# EAGLE design Teensy-FC-BOB2 (EAGLE 8.0.0)
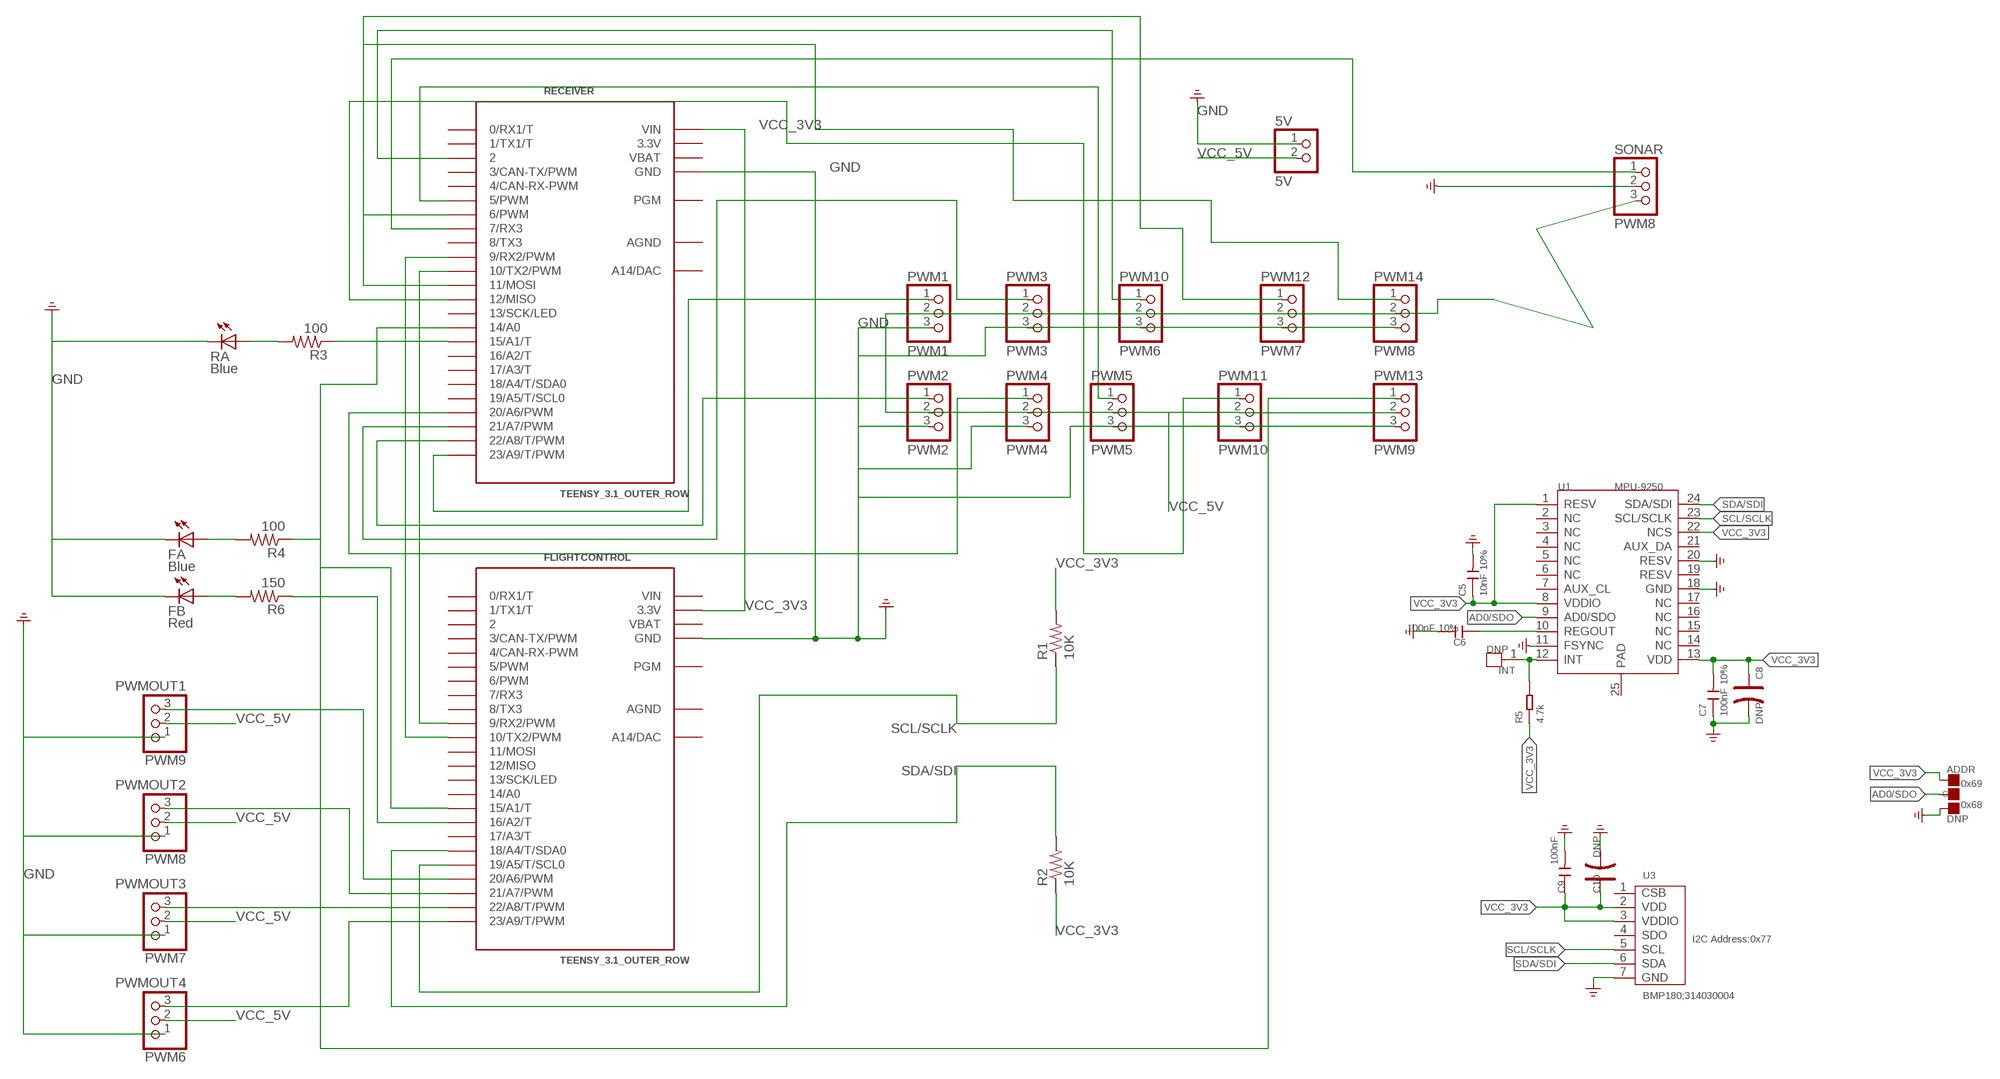
[diagram p0: schematic, sheet 1]

## Parts
5V  5V  PINHD-1X2  [1X02]
ADDR  DNP  PAD-JUMPER-3P-40*40  [3P-SMD-L4.1*W1.5MM]
C5  10nF 10%  CAP-0603  [C0603]
C6  100nF 10%  CAP-0603  [C0603]
C7  100nF 10%  CAP-0603  [C0603]
C8  DNP  CAP-POLAR-AVX-A  [AVX-A]
C9  100nF  CAP-0603  [C0603]
C10  DNP  CAP-POLAR-AVX-A  [AVX-A]
FA  Blue  LEDCHIP-LED0603  [CHIP-LED0603]
FB  Red  LEDCHIP-LED0603  [CHIP-LED0603]
FLIGHTCONTROL  TEENSY_3.1_OUTER_ROW  [TEENSY3-OUTER_ROW]
INT  DNP  HEADER-1P-35  [1P-65/35MIL]
PWM1  PWM1  PINHD-1X3  [1X03]
PWM2  PWM2  PINHD-1X3  [1X03]
PWM3  PWM3  PINHD-1X3  [1X03]
PWM4  PWM4  PINHD-1X3  [1X03]
PWM5  PWM5  PINHD-1X3  [1X03]
PWM6  PWMOUT4  PINHD-1X3  [1X03]
PWM7  PWMOUT3  PINHD-1X3  [1X03]
PWM8  PWMOUT2  PINHD-1X3  [1X03]
PWM9  PWMOUT1  PINHD-1X3  [1X03]
PWM10  PWM6  PINHD-1X3  [1X03]
PWM11  PWM10  PINHD-1X3  [1X03]
PWM12  PWM7  PINHD-1X3  [1X03]
PWM13  PWM9  PINHD-1X3  [1X03]
PWM14  PWM8  PINHD-1X3  [1X03]
R1  10K  R-US_R0603  [R0603]
R2  10K  R-US_R0603  [R0603]
R3  100  R-US_R0603  [R0603]
R4  100  R-US_R0603  [R0603]
R5  4.7k  RES-0603  [R0603]
R6  150  R-US_R0603  [R0603]
RA  Blue  LEDCHIP-LED0603  [CHIP-LED0603]
RECEIVER  TEENSY_3.1_OUTER_ROW  [TEENSY3-OUTER_ROW]
SONAR  PWM8  PINHD-1X3  [1X03]
U1  MPU-9250  [LEAD-QFN24]
U3  BMP180;314030004  BMP180  [LGA-7]

## Nets
AD0/SDO: ADDR.MM(C) U1.9(AD0/SDO)
GND: 5V.1 ADDR.11(R) C5.2 C6.2 C7.1 C8.- C9.2 C10.- FA.C FB.C FLIGHTCONTROL.GND FLIGHTCONTROL.GND1(GND) PWM1.3 PWM2.3 PWM3.3 PWM4.3 PWM5.3 PWM6.1 PWM7.1 PWM8.1 PWM9.1 PWM10.3 PWM11.3 PWM12.3 PWM13.3 PWM14.3 RA.C RECEIVER.GND RECEIVER.GND1(GND) SONAR.2 U1.11(FSYNC) U1.18(GND) U1.20(RESV) U3.7(GND) ; supply symbol labelled GND_POWER
N$1: FLIGHTCONTROL.9(9/RX2/PWM) RECEIVER.10(10/TX2/PWM)
N$2: FLIGHTCONTROL.10(10/TX2/PWM) RECEIVER.9(9/RX2/PWM)
N$3: C6.1 U1.10(REGOUT)
N$4: INT.1 R5.2 U1.12(INT)
N$5: PWM1.1 RECEIVER.23/A9(23/A9/T/PWM)
N$6: PWM2.1 RECEIVER.22/A8(22/A8/T/PWM)
N$7: PWM3.1 RECEIVER.21/A7(21/A7/PWM)
N$8: PWM4.1 RECEIVER.20/A6(20/A6/PWM)
N$9: PWM5.1 RECEIVER.5(5/PWM)
N$10: FLIGHTCONTROL.20/A6(20/A6/PWM) PWM9.3
N$11: FLIGHTCONTROL.21/A7(21/A7/PWM) PWM8.3
N$12: FLIGHTCONTROL.22/A8(22/A8/T/PWM) PWM7.3
N$13: FLIGHTCONTROL.23/A9(23/A9/T/PWM) PWM6.3
N$14: FLIGHTCONTROL.15/A1(15/A1/T) R4.1
N$15: FA.A R4.2
N$16: R3.1 RECEIVER.15/A1(15/A1/T)
N$17: R3.2 RA.A
N$18: FLIGHTCONTROL.16/A2(16/A2/T) R6.1
N$19: FB.A R6.2
N$20: PWM10.1 RECEIVER.2
N$21: RECEIVER.7(7/RX3) SONAR.1
N$22: PWM1.2 PWM2.2 PWM3.2 PWM4.2 PWM5.2 PWM10.2 PWM11.2 PWM12.2 PWM13.2 PWM14.2 SONAR.3
N$23: PWM12.1 RECEIVER.6(6/PWM)
N$24: PWM14.1 RECEIVER.11(11/MOSI)
N$25: PWM11.1 RECEIVER.12(12/MISO)
N$26: PWM13.1 RECEIVER.14/A0
SCL/SCLK: FLIGHTCONTROL.19/A5(19/A5/T/SCL0) R1.1 U1.23(SCL/SCLK) U3.5(SCL)
SDA/SDI: FLIGHTCONTROL.18/A4(18/A4/T/SDA0) R2.2 U1.24(SDA/SDI) U3.6(SDA)
VCC_3V3: ADDR.00(L) C5.1 C7.2 C8.+ C9.1 C10.+ FLIGHTCONTROL.3.3V FLIGHTCONTROL.3.3V1(3.3V) R1.2 R2.1 R5.1 RECEIVER.VIN U1.1(RESV) U1.8(VDDIO) U1.13(VDD) U1.22(NCS) U3.2(VDD) U3.3(VDDIO)
VCC_5V: 5V.2 PWM6.2 PWM7.2 PWM8.2 PWM9.2
Unconnected: FLIGHTCONTROL.0(0/RX1/T) FLIGHTCONTROL.1(1/TX1/T) FLIGHTCONTROL.2 FLIGHTCONTROL.3(3/CAN-TX/PWM) FLIGHTCONTROL.4(4/CAN-RX-PWM) FLIGHTCONTROL.5(5/PWM) FLIGHTCONTROL.6(6/PWM) FLIGHTCONTROL.7(7/RX3) FLIGHTCONTROL.8(8/TX3) FLIGHTCONTROL.11(11/MOSI) FLIGHTCONTROL.12(12/MISO) FLIGHTCONTROL.13(13/SCK/LED) FLIGHTCONTROL.14/A0 FLIGHTCONTROL.17/A3(17/A3/T) FLIGHTCONTROL.PGM FLIGHTCONTROL.RESET/DAC(A14/DAC) RECEIVER.0(0/RX1/T) RECEIVER.1(1/TX1/T) RECEIVER.3(3/CAN-TX/PWM) RECEIVER.4(4/CAN-RX-PWM) RECEIVER.8(8/TX3) RECEIVER.13(13/SCK/LED) RECEIVER.16/A2(16/A2/T) RECEIVER.17/A3(17/A3/T) RECEIVER.18/A4(18/A4/T/SDA0) RECEIVER.19/A5(19/A5/T/SCL0) RECEIVER.PGM RECEIVER.RESET/DAC(A14/DAC) U1.2(NC) U1.3(NC) U1.4(NC) U1.5(NC) U1.6(NC) U1.7(AUX_CL) U1.14(NC) U1.15(NC) U1.16(NC) U1.17(NC) U1.19(RESV) U1.21(AUX_DA) U1.25(PAD) U3.1(CSB) U3.4(SDO)

## Notes on the sheet
- 0x69
- 0x68
- I2C Address:0x77

## Power pins joined to a net without a drawn wire
3.3V: RECEIVER.3.3V RECEIVER.3.3V1(3.3V)
AGND: FLIGHTCONTROL.AGND RECEIVER.AGND
VBAT: FLIGHTCONTROL.VBAT RECEIVER.VBAT
VIN: FLIGHTCONTROL.VIN

## Library data of the parts
5V = pinhead:PINHD-1X2: PIN HEADER
ADDR = Discrete-new:PAD-JUMPER-3P; PARTNO: DNP
C5-C7 C9 = Discrete-new:CAP: Ceramic Capacitors
C8 C10 = Discrete-new:CAP-POLAR: Electrolytic Capacitors,Tantalum Capacitors and Super Capacitors
FA FB RA = led:LED: LED OSRAM: - CHIPLED LG R971, LG N971, LY N971, LG Q971, LY Q971, LO R971, LY R971 LH N974, LH R974 LS Q976, LO Q976, LY Q976 LO Q996 - Hyper CHIPLED LW Q18S LB Q993, LB Q99A, LB R99A - SideLED LS A670, LO A670, LY A670, LG A670, LP A670 LB A673, LV A673, LT A673, LW A673 LH A674 LY A675 LS A676, LA A676, LO A676, LY A676, LW A676 LS A679, LY A679, LG A679 - Hyper Micro SIDELED® LS Y876, LA Y876, LO Y876, LY Y876 LT Y87S - SmartLED LW L88C, LW L88S LB L89C, LB L89S, LG L890 LS L89K, LO L89K, LY L89K LS L896, LA L896, LO L896, LY L896 - TOPLED LS T670, LO T670, LY T670, LG T670, LP T670 LSG T670, LSP T670, LSY T670, LOP T670, LYG T670 LG T671, LOG T671, LSG T671 LB T673, LV T673, LT T673, LW T673 LH T674 LS T676, LA T676, LO T676, LY T676, LB T676, LH T676, LSB T676, LW T676 LB T67C, LV T67C, LT T67C, LS T67K, LO T67K, LY T67K, LW E67C LS E67B, LA E67B, LO E67B, LY E67B, LB E67C, LV E67C, LT E67C LW T67C LS T679, LY T679, LG T679 LS T770, LO T770, LY T770, LG T770, LP T770 LB T773, LV T773, LT T773, LW T773 LH T774 LS E675, LA E675, LY E675, LS T675 LS T776, LA T776, LO T776, LY T776, LB T776 LHGB T686 LT T68C, LB T68C - Hyper Mini TOPLED® LB M676 - Mini TOPLED Santana® LG M470 LS M47K, LO M47K, LY M47K Source: http://www.osram.convergy.de LUXEON: - LUMILED® LXK2-PW12-R00, LXK2-PW12-S00, LXK2-PW14-U00, LXK2-PW14-V00 LXK2-PM12-R00, LXK2-PM12-S00, LXK2-PM14-U00 LXK2-PE12-Q00, LXK2-PE12-R00, LXK2-PE12-S00, LXK2-PE14-T00, LXK2-PE14-U00 LXK2-PB12-K00, LXK2-PB12-L00, LXK2-PB12-M00, LXK2-PB14-N00, LXK2-PB14-P00, LXK2-PB14-Q00 LXK2-PR12-L00, LXK2-PR12-M00, LXK2-PR14-Q00, LXK2-PR14-R00 LXK2-PD12-Q00, LXK2-PD12-R00, LXK2-PD12-S00 LXK2-PH12-R00, LXK2-PH12-S00 LXK2-PL12-P00, LXK2-PL12-Q00, LXK2-PL12-R00 Source: www.luxeon.com KINGBRIGHT: KA-3528ASYC Source: www.kingbright.com
FLIGHTCONTROL RECEIVER = Teensy_3_and_LC_Series_Boards_v1.0:TEENSY_3.1_OUTER_ROW: Footprint for Teensy 3.1 or 3.2 board using all pin connections on the outer perimeter
INT = Connector-new:HEADER-1P
PWM1-PWM14 SONAR = pinhead:PINHD-1X3: PIN HEADER
R1-R4 R6 = resistor:R-US_: RESISTOR, American symbol
R5 = Discrete-new:RES
U1 = template:MPU-9250
U3 = template:BMP180: Digital pressure sensor

## Board
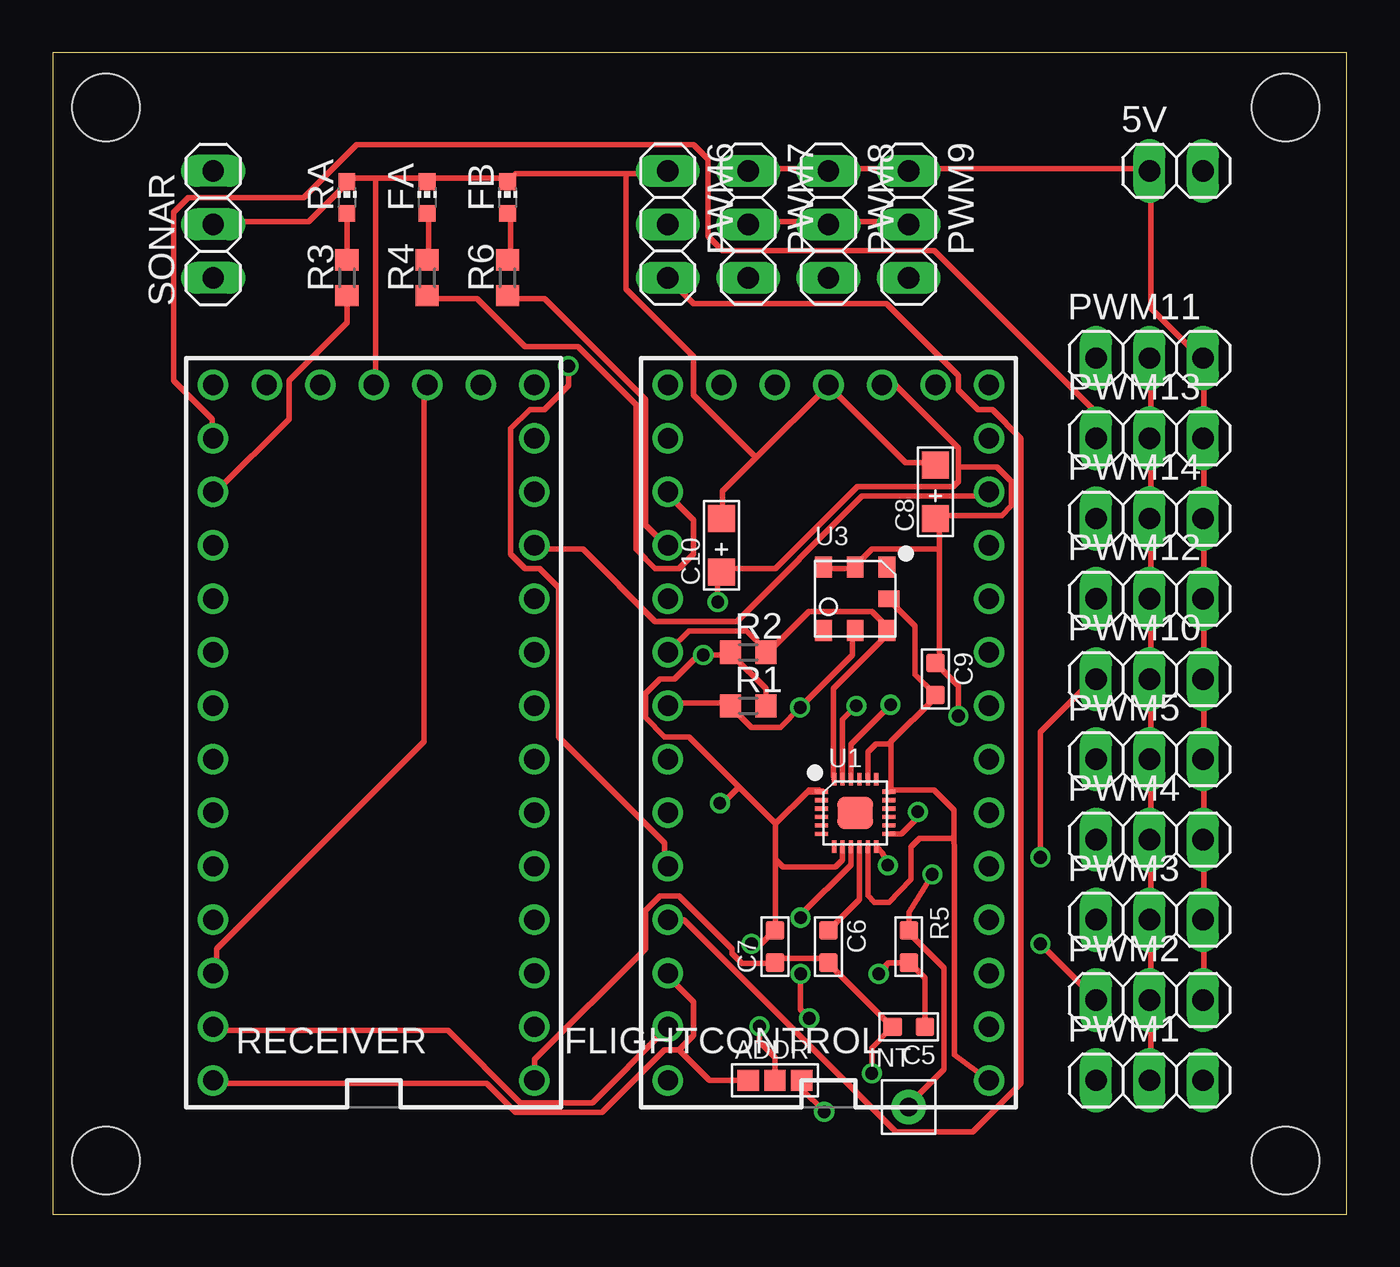
[diagram p1: board, top side]
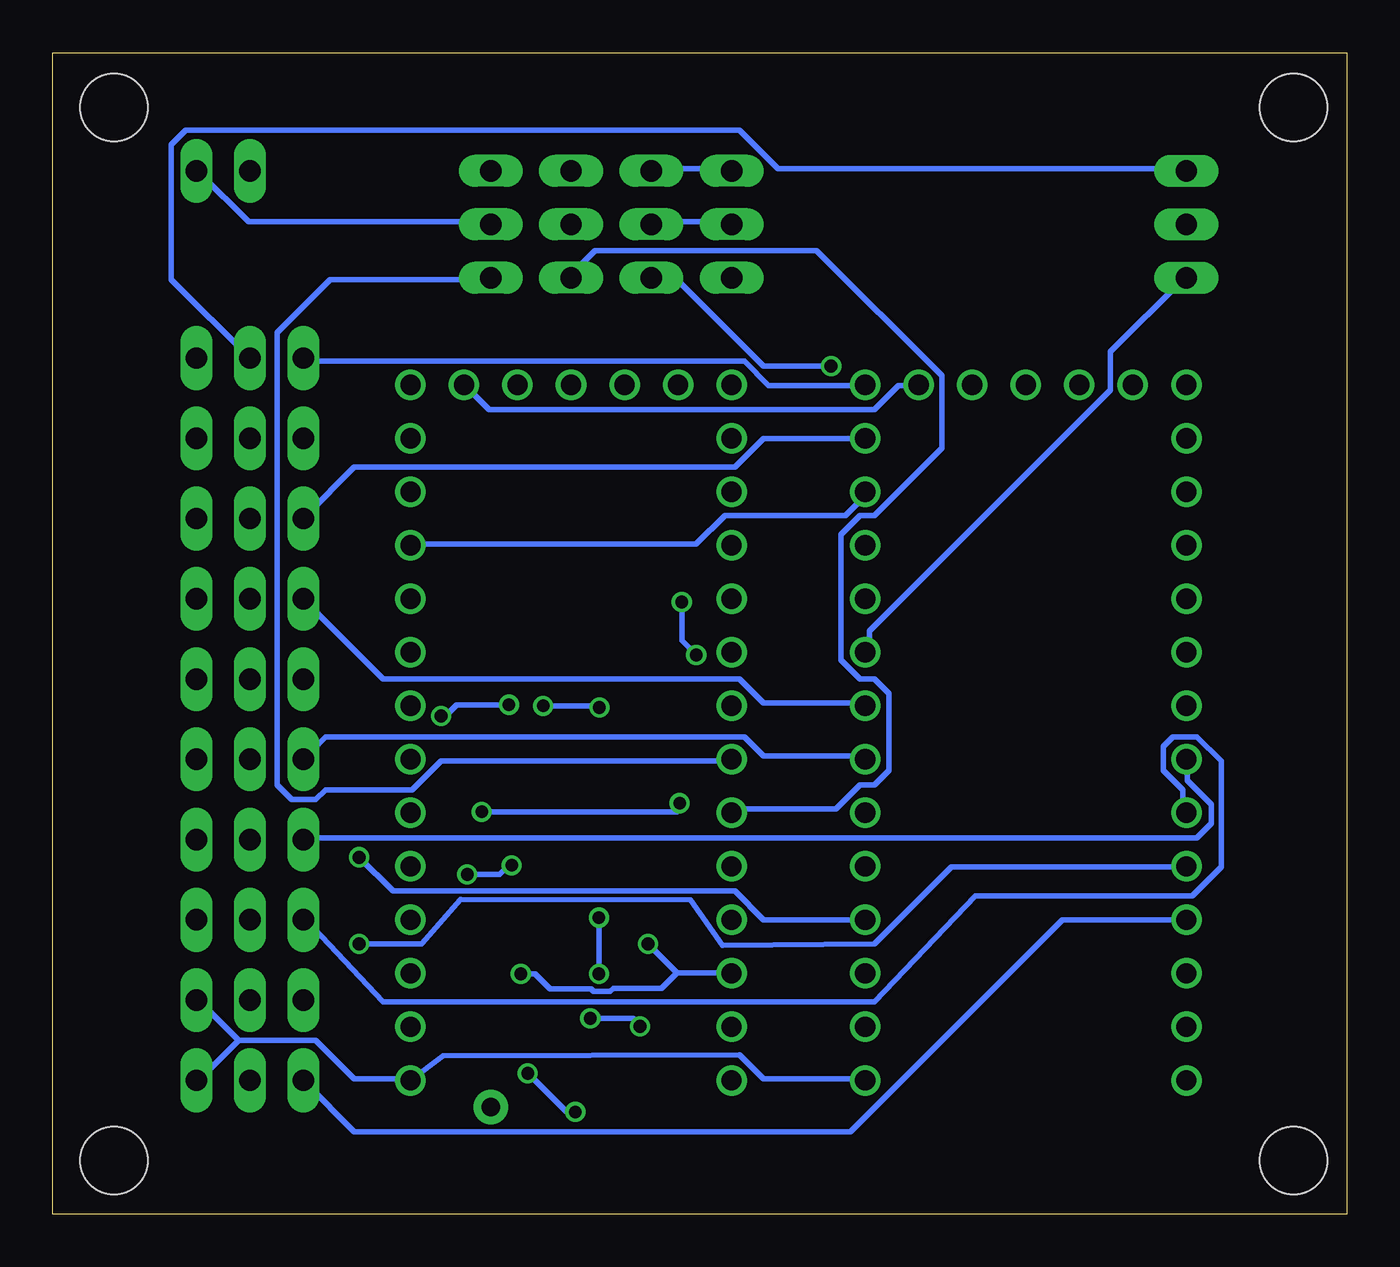
[diagram p2: board, bottom side, seen from below]

Size 61.44 x 55.14 mm. Coordinates in mm from the lower left corner, seen from the top.
Outline: 0,0 61.44,0 61.44,55.14 0,55.14 0,0
Copper layers (1*16): Top 0.0356mm / dielectric 1.5011mm / Bottom 0.0356mm
Design rules "LaenPCBOrder *": minimum track width 6mil, minimum drill 13mil, track to track 6mil, track to pad 6mil, pad to pad 6mil, via to via 6mil, smd to smd 6mil, copper to edge 15mil, drill to drill 6mil, minimum pad ring 7mil, minimum via ring 7mil, stop-mask expansion 3mil, vias tented up to drill 0mil, thermal gap 10mil
Holes 3.2 mm at 2.54,2.54 58.54,2.54 58.54,52.54 2.54,52.54

### Footprints (pad centres in the part's own frame; a part is rotated, then mirrored left to right if it is on the bottom)
1X02 = drill 1.016 long: 1 -1.27,0; 2 1.27,0
3P-SMD-L4.1*W1.5MM = smd 1.016 x 1.016: 00 -1.27,0; 11 1.27,0; MM 0,0
C0603 = smd 0.889 x 0.889: 1 0,0.762; 2 0,-0.762
AVX-A = smd 1.27 x 1.27: + -1.27,0; - 1.27,0
CHIP-LED0603 = smd 0.8 x 0.8: A 0,-0.75; C 0,0.75
TEENSY3-OUTER_ROW = drill 0.965: 0 -7.62,13.97; 1 -7.62,11.43; 2 -7.62,8.89; 3 -7.62,6.35; 3.3V 7.62,11.43; 3.3V1 -2.54,-16.51; 4 -7.62,3.81; 5 -7.62,1.27; 6 -7.62,-1.27; 7 -7.62,-3.81; 8 -7.62,-6.35; 9 -7.62,-8.89; 10 -7.62,-11.43; 11 -7.62,-13.97; 12 -7.62,-16.51; 13 7.62,-16.51; 14/A0 7.62,-13.97; 15/A1 7.62,-11.43; 16/A2 7.62,-8.89; 17/A3 7.62,-6.35; 18/A4 7.62,-3.81; 19/A5 7.62,-1.27; 20/A6 7.62,1.27; 21/A7 7.62,3.81; 22/A8 7.62,6.35; 23/A9 7.62,8.89; AGND 7.62,13.97; GND -7.62,16.51; GND1 0,-16.51; PGM 2.54,-16.51; RESET/DAC 5.08,-16.51; VBAT -5.08,-16.51; VIN 7.62,16.51
1P-65/35MIL = drill 0.889 pad 1.651: 1 0,0
1X03 = drill 1.016 long: 1 -2.54,0; 2 0,0; 3 2.54,0
R0603 = smd 1 x 1.1: 1 -0.85,0; 2 0.85,0
R0603' = smd 0.889 x 0.889: 1 0,0.762; 2 0,-0.762
LEAD-QFN24 = smd 0.6 x 0.2: 1 -1.6,1; 2 -1.6,0.6; 3 -1.6,0.2; 4 -1.6,-0.2; 5 -1.6,-0.6; 6 -1.6,-1; 13 1.6,-1; 14 1.6,-0.6; 15 1.6,-0.2; 16 1.6,0.2; 17 1.6,0.6; 18 1.6,1 | smd 0.2 x 0.6: 7 -1,-1.6; 8 -0.6,-1.6; 9 -0.2,-1.6; 10 0.2,-1.6; 11 0.6,-1.6; 12 1,-1.6; 19 1,1.6; 20 0.6,1.6; 21 0.2,1.6; 22 -0.2,1.6; 23 -0.6,1.6; 24 -1,1.6 | smd 1.7 x 1.54: 25 0,0
LGA-7 = smd 0.8 x 1: 1 1.5,1.5; 2 0,1.5; 3 -1.5,1.5; 4 -1.5,-1.5; 5 0,-1.5; 6 1.5,-1.5 | smd 1 x 0.8: 7 1.6,0

### Placement (x,y rotation side)
5V  53.34,49.53 0 top
ADDR  34.29,6.35 0 top
C5  40.64,8.89 270 top
C6  36.83,12.7 0 top
C7  34.29,12.7 180 top
C8  41.91,34.29 90 top
C9  41.91,25.4 0 top
C10  31.75,31.75 90 top
FA  17.78,48.26 0 top
FB  21.59,48.26 0 top
FLIGHTCONTROL  36.83,22.86 180 top
INT  40.64,5.08 0 top
PWM1  52.07,6.35 0 top
PWM2  52.07,10.16 0 top
PWM3  52.07,13.97 0 top
PWM4  52.07,17.78 0 top
PWM5  52.07,21.59 0 top
PWM6  29.21,46.99 270 top
PWM7  33.02,46.99 270 top
PWM8  36.83,46.99 270 top
PWM9  40.64,46.99 270 top
PWM10  52.07,25.4 0 top
PWM11  52.07,40.64 0 top
PWM12  52.07,29.21 0 top
PWM13  52.07,36.83 0 top
PWM14  52.07,33.02 0 top
R1  33.02,24.13 0 top
R2  33.02,26.67 0 top
R3  13.97,44.45 90 top
R4  17.78,44.45 90 top
R5  4.7k  [R0603']  40.64,12.7 180 top
R6  21.59,44.45 90 top
RA  13.97,48.26 0 top
RECEIVER  15.24,22.86 180 top
SONAR  7.62,46.99 90 top
U1  38.1,19.05 0 top
U3  38.1,29.21 0 top

### Tracks (layer width: path | path; a pad name or v marks a point on that pad's centre or on a via)
3.3V
  Top 0.254: RECEIVER.3.3V 7.8,11.45 7.8,12.6 17.63,22.43 17.63,39.34 RECEIVER.3.3V1
AD0/SDO  (via drill 0.6)
  Top 0.254: U1.9 37.9,16.59 35.56,14.25 35.56,14.22 v35.51,14.07 | v35.51,11.41 35.51,9.73 35.92,9.32 v35.92,9.3 | v33.55,8.91 33.55,8.18 34.29,7.44 ADDR.MM
  Bottom 0.254: v35.51,14.07 v35.51,11.41 | v35.92,9.3 33.88,9.3 33.5,8.91 v33.55,8.91
AGND
  Top 0.254: RECEIVER.AGND 7.8,8.71 18.77,8.71 22.2,5.28 25.63,5.28 29.06,8.71 FLIGHTCONTROL.AGND
GND  (via drill 0.6)
  Top 0.254: 36.83,39.34 33.4,35.92 | 33.4,35.92 31.8,34.31 31.8,33.17 C10.- | 36.83,39.34 40.49,35.69 41.86,35.69 C8.- | 36.83,39.34 FLIGHTCONTROL.GND1 | 36.83,49.63 33.17,49.63 PWM7.1 | 36.83,49.63 40.49,49.63 PWM9.1 40.72,49.63 51.92,49.63 5V.1 52.15,49.4 52.15,43 54.43,40.72 PWM11.3 54.66,40.49 54.66,36.83 | 36.83,49.63 PWM8.1 | 15.34,49.17 17.63,49.17 FA.C 17.86,49.17 21.51,49.17 FB.C 21.74,49.17 21.97,49.4 27.23,49.4 | 15.34,49.17 13.97,49.17 RA.C 13.97,48.95 12.14,47.12 7.8,47.12 SONAR.2 | 15.34,49.17 15.34,39.57 RECEIVER.GND1 | 27.23,49.4 29.06,49.4 PWM6.1 | 33.4,35.92 30.43,38.89 30.43,40.72 27.23,43.92 27.23,49.4 | RECEIVER.GND 22.88,6.43 22.88,7.34 28.14,12.6 28.14,14.43 28.83,15.11 29.74,15.11 32.26,12.6 32.26,12.37 32.72,11.91 34.09,11.91 C7.1 34.31,12.14 36.83,12.14 C6.2 36.83,11.91 39.8,8.94 C5.2 38.89,7.9 v38.89,6.68 | 39.8,22.43 39.8,20.14 | 39.8,22.43 41.86,24.49 C9.2 41.86,24.71 40.95,25.63 40.95,27.91 39.8,29.06 U3.7 | 54.66,25.4 54.66,21.74 PWM5.3 54.66,21.51 54.66,17.86 PWM4.3 54.66,17.63 54.66,13.97 | 54.66,13.97 54.66,10.31 PWM2.3 | 54.66,13.97 PWM3.3 | 54.66,25.4 54.66,29.06 PWM12.3 54.66,29.29 54.66,32.94 PWM14.3 54.66,33.17 54.66,36.83 | 54.66,25.4 PWM10.3 | 39.8,20.14 40.26,20.14 41.84,20.14 42.78,19.2 42.78,18.77 42.79,17.95 | 42.79,17.95 42.8,17.17 42.8,7.57 FLIGHTCONTROL.GND | 39.8,20.14 U1.18 | 54.66,36.83 PWM13.3 | U1.20 38.71,21.95 39.09,22.33 39.7,22.33 39.8,22.43 | ADDR.11 35.56,5.94 36.65,4.85 v36.63,4.85 | U1.11 38.7,15.12 39.01,14.81 39.7,14.81 40.74,15.9 40.74,17.44 41.14,17.84 42.69,17.84 42.79,17.95
  Bottom 0.254: PWM6.1 29.29,49.63 32.94,49.63 PWM7.1 | 52.6,8.25 48.95,8.25 47.12,6.43 44.6,6.43 FLIGHTCONTROL.GND 42.9,7.52 28.83,7.57 27.69,6.43 22.88,6.43 RECEIVER.GND | 52.6,8.25 54.43,10.08 PWM2.3 | 52.6,8.25 54.43,6.43 PWM1.3 | v36.63,4.85 37.03,4.85 38.84,6.66 38.86,6.66 v38.89,6.68
N$1
  Bottom 0.254: FLIGHTCONTROL.9 44.37,31.8 30.89,31.8 29.52,33.17 23.8,33.17 22.88,34.09 RECEIVER.10
N$2
  Top 0.254: RECEIVER.9 22.88,31.57 25.17,31.57 28.6,28.14 32.49,28.14 38.43,34.09 44.37,34.09 FLIGHTCONTROL.10
N$3
  Top 0.254: U1.10 38.3,14.93 C6.1
N$4  (via drill 0.6)
  Top 0.254: INT.1 40.72,5.28 42.32,6.88 42.32,11.68 40.72,13.28 R5.2 40.64,14.33 41.76,16.1 v41.76,16.13 | v39.65,16.56 39.39,17.16 U1.12
  Bottom 0.254: v41.76,16.13 40.23,16.13 39.67,16.69 39.67,16.51 v39.65,16.56
N$5
  Bottom 0.254: RECEIVER.23/A9 13.51,13.97 23.57,3.91 47.12,3.91 49.4,6.2 PWM1.1
N$6  (via drill 0.61)
  Top 0.254: v46.89,12.83 49.4,10.31 PWM2.1
  Bottom 0.254: v46.89,12.83 43.92,12.83 42.06,14.93 31.17,14.91 29.64,12.75 22.43,12.83 18.77,16.48 7.8,16.48 RECEIVER.22/A8
N$7
  Bottom 0.254: RECEIVER.21/A7 7.8,19.23 7.8,20.14 8.71,21.06 8.71,22.2 8.25,22.66 7.11,22.66 5.97,21.51 5.97,16.48 7.34,15.11 17.63,15.11 22.43,10.08 45.74,10.08 49.4,13.97 PWM3.1
N$8
  Bottom 0.254: RECEIVER.20/A6 7.57,21.51 7.57,20.6 6.43,19.46 6.43,18.54 7.11,17.86 49.4,17.86 PWM4.1
N$9
  Bottom 0.254: RECEIVER.5 22.88,21.74 27.69,21.74 28.6,22.66 48.49,22.66 49.4,21.74 PWM5.1
N$10
  Bottom 0.254: FLIGHTCONTROL.20/A6 29.29,21.51 43,21.51 44.37,20.14 48.49,20.14 48.95,19.68 50.09,19.68 50.77,20.37 50.77,41.86 48.26,44.37 40.72,44.37 PWM9.3
N$11
  Bottom 0.254: FLIGHTCONTROL.21/A7 29.06,19.23 24.26,19.23 23.11,20.37 22.43,20.37 21.74,21.06 21.74,24.71 22.43,25.4 23.11,25.4 24.03,26.31 24.03,32.26 23.11,33.17 22.43,33.17 19.23,36.37 19.23,39.8 25.17,45.74 35.69,45.74 36.83,44.6 PWM8.3
N$12  (via drill 0.61)
  Top 0.254: v24.49,40.26 24.49,39.34 23.34,38.2 22.66,38.2 21.74,37.29 21.74,31.34 22.43,30.66 23.11,30.66 24.03,29.74 24.03,22.66 29.06,17.63 29.06,16.71 FLIGHTCONTROL.22/A8
  Bottom 0.254: v24.49,40.26 27.69,40.26 31.8,44.37 32.94,44.37 PWM7.3
N$13
  Top 0.254: FLIGHTCONTROL.23/A9 29.97,13.97 40.03,3.91 43.69,3.91 45.97,6.2 45.97,36.83 44.6,38.2 43.92,38.2 43,39.12 43,39.8 39.57,43.23 30.43,43.23 PWM6.3
N$14
  Top 0.254: R4.1 17.86,43.46 20.14,43.46 22.43,41.17 24.94,41.17 27.69,38.43 27.69,31.57 28.6,30.66 29.74,30.66 30.43,31.34 30.43,32.94 29.29,34.09 FLIGHTCONTROL.15/A1
N$15
  Top 0.254: FA.A 17.86,47.35 17.86,45.52 R4.2
N$16
  Top 0.254: R3.1 13.97,42.32 11.23,39.57 11.23,37.74 7.8,34.31 RECEIVER.15/A1
N$17
  Top 0.254: R3.2 RA.A
N$18
  Top 0.254: R6.1 21.74,43.46 23.34,43.46 28.14,38.66 28.14,32.72 29.06,31.8 FLIGHTCONTROL.16/A2
N$19
  Top 0.254: FB.A 21.74,47.35 21.74,45.52 R6.2
N$20  (via drill 0.61)
  Top 0.254: v46.89,16.94 46.89,22.88 49.4,25.4 PWM10.1
  Bottom 0.254: RECEIVER.2 27.69,13.97 29.06,15.34 45.29,15.34 v46.89,16.94
N$21
  Bottom 0.254: RECEIVER.7 22.66,26.77 22.66,27.69 11.23,39.12 11.23,40.95 7.8,44.37 SONAR.1
N$22
  Top 0.254: 52.15,25.4 52.15,21.74 PWM5.2 52.15,21.51 52.15,17.86 PWM4.2 52.15,17.63 52.15,13.97 | PWM1.2 52.15,6.43 52.15,10.08 PWM2.2 52.15,10.31 52.15,13.97 | 52.15,13.97 PWM3.2 | 52.15,25.4 52.15,29.06 PWM12.2 52.15,29.29 52.15,32.94 PWM14.2 52.15,33.17 52.15,36.83 | 52.15,25.4 PWM10.2 | 52.15,36.83 52.15,40.49 PWM11.2 | 52.15,36.83 PWM13.2
  Bottom 0.254: PWM11.2 55.8,44.37 55.8,50.77 55.12,51.46 28.83,51.46 27,49.63 7.8,49.63 SONAR.3
N$23
  Bottom 0.254: RECEIVER.6 22.88,24.26 27.69,24.26 28.83,25.4 45.74,25.4 49.4,29.06 PWM12.1
N$24
  Bottom 0.254: RECEIVER.11 27.69,36.83 29.06,35.46 47.12,35.46 49.4,33.17 PWM14.1
N$25
  Bottom 0.254: RECEIVER.12 22.88,39.34 27.46,39.34 28.6,40.49 49.4,40.49 PWM11.1
N$26
  Top 0.254: RECEIVER.14/A0 7.57,36.83 7.57,37.74 5.74,39.57 5.74,47.57 6.43,48.26 11.91,48.26 14.43,50.77 30.43,50.77 31.11,50.09 31.11,46.43 31.8,45.74 41.86,45.74 49.4,38.2 49.4,36.83 PWM13.1
SCL/SCLK  (via drill 0.6)
  Top 0.254: U3.5 37.97,27.69 37.97,26.54 v35.48,24.05 34.54,23.11 33.17,23.11 32.26,24.03 R1.1 32.03,24.26 29.29,24.26 FLIGHTCONTROL.19/A5 | U1.23 37.5,23.48 v38.15,24.13
  Bottom 0.254: v38.15,24.13 35.56,24.13 v35.48,24.05 | v35.48,24.05 35.42,23.99 v35.48,24.05
SDA/SDI
  Top 0.254: U1.24 37.06,20.83 37.06,24.94 39.8,27.69 U3.6 39.57,27.91 38.89,28.6 35.92,28.6 34.09,26.77 R2.2 33.86,26.77 32.94,27.69 30.2,27.69 29.29,26.77 FLIGHTCONTROL.18/A4
VBAT
  Bottom 0.254: RECEIVER.VBAT 20.37,39.34 21.29,39.34 22.43,38.2 40.72,38.2 41.86,39.34 FLIGHTCONTROL.VBAT
VCC_3V3  (via drill 0.6, 0.61)
  Top 0.254: 29.74,7.8 29.06,7.8 26.09,4.83 21.97,4.83 20.6,6.2 7.8,6.2 RECEIVER.VIN | 29.74,7.8 30.43,8.48 30.43,10.08 29.29,11.23 FLIGHTCONTROL.3.3V | U3.3 36.6,30.66 37.97,30.66 U3.2 38.2,30.89 38.89,31.57 42.09,31.57 | 42.09,31.57 42.09,32.94 C8.+ 42.09,33.17 45.06,33.17 45.52,33.63 45.52,34.77 44.83,35.46 43,35.46 | 42.09,31.57 42.09,26.31 C9.1 43,25.07 v43,23.65 | 43,35.46 43,36.37 40.03,39.34 39.57,39.34 FLIGHTCONTROL.3.3V1 | 43,35.46 43,34.77 42.77,34.54 38.2,34.54 34.31,30.66 31.8,30.66 C10.+ 31.57,30.43 v31.57,29.06 | R1.2 33.86,24.26 33.86,24.94 32.26,26.54 R2.1 32.03,26.54 v30.89,26.54 30.66,26.54 29.52,25.4 28.83,25.4 28.14,24.71 28.14,23.57 29.06,22.66 30.2,22.66 32.58,20.28 | C5.1 41.4,11.23 40.72,11.91 R5.1 39.67,11.94 39.55,11.81 39.55,11.73 v39.22,11.41 | 35.82,20.05 34.31,18.54 | 35.82,20.05 35.92,20.14 36.37,20.14 U1.1 | 34.31,16.84 34.31,13.51 C7.2 34.09,13.28 33.63,12.83 v33.17,12.83 | 34.31,16.84 34.31,18.54 | 32.58,20.28 34.31,18.54 | 36.54,20.09 U1.1 | U1.1 35.82,20.05 | U1.8 37.5,16.82 37.16,16.48 34.67,16.48 34.31,16.84 | 29.74,7.8 31.19,6.35 ADDR.00 | U1.13 40.3,18.05 41.12,18.87 41.12,19.05 v41.07,19.1 | v31.67,19.51 31.8,19.51 32.58,20.28 | U1.22 37.9,22.3 v39.78,24.18
  Bottom 0.254: v31.57,29.06 31.57,27.23 v30.89,26.54 | 31.8,11.45 29.29,11.45 FLIGHTCONTROL.3.3V | v33.17,12.83 31.8,11.45 | v39.22,11.41 38.53,11.41 37.82,10.69 35.89,10.69 35.76,10.57 34.98,10.57 34.82,10.72 32.54,10.72 31.8,11.45 | v41.07,19.1 31.8,19.1 31.62,19.28 31.62,19.46 v31.67,19.51 | v39.78,24.18 42.27,24.18 43.05,23.39 43.05,23.6 v43,23.65
VCC_5V
  Top 0.254: 36.83,47.12 33.17,47.12 PWM7.2 | 36.83,47.12 40.49,47.12 PWM9.2 | 36.83,47.12 PWM8.2
  Bottom 0.254: PWM6.2 29.29,47.12 32.94,47.12 PWM7.2 | 5V.2 54.43,49.4 52.15,47.12 40.72,47.12 PWM9.2